# EAGLE design Analog_Greippi (EAGLE 7.4.0)
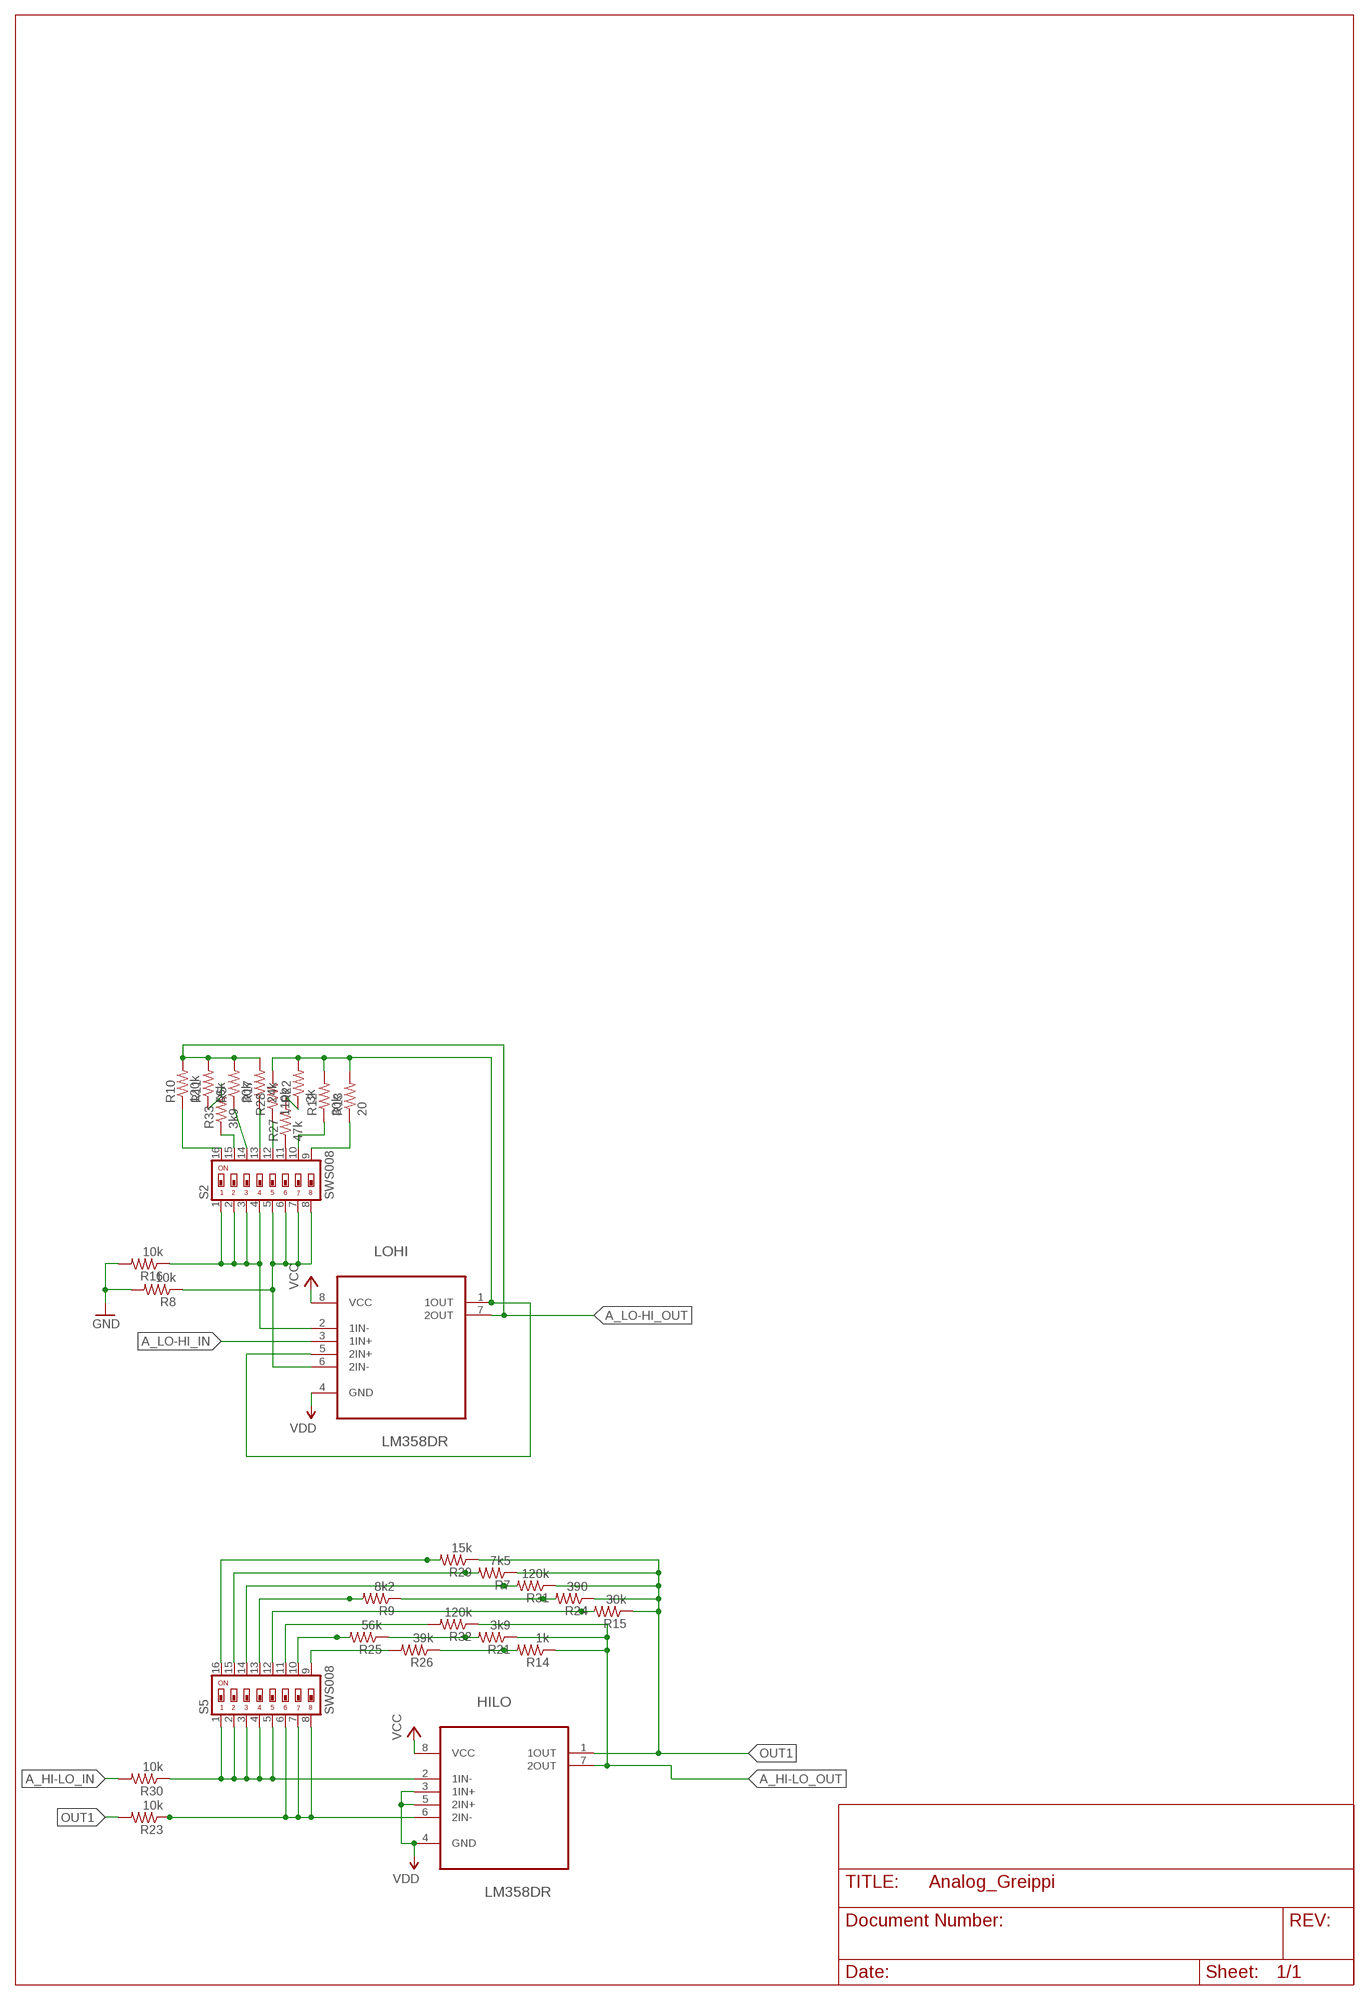
[diagram p0: schematic, sheet 1]

## Parts
HILO  LM358DR  [SOIC127P600X175-8N]
LOHI  LM358DR  [SOIC127P600X175-8N]
R5  30k  R-US_R0805  [R0805]
R7  7k5  R-US_R0805  [R0805]
R8  10k  R-US_R0805  [R0805]
R9  8k2  R-US_R0805  [R0805]
R10  120k  R-US_R0805  [R0805]
R11  56k  R-US_R0805  [R0805]
R12  30k  R-US_R0805  [R0805]
R13  20  R-US_R0805  [R0805]
R14  1k  R-US_R0805  [R0805]
R15  30k  R-US_R0805  [R0805]
R16  10k  R-US_R0805  [R0805]
R17  24k  R-US_R0805  [R0805]
R21  3k9  R-US_R0805  [R0805]
R22  3k  R-US_R0805  [R0805]
R23  10k  R-US_R0805  [R0805]
R24  390  R-US_R0805  [R0805]
R25  56k  R-US_R0805  [R0805]
R26  39k  R-US_R0805  [R0805]
R27  47k  R-US_R0805  [R0805]
R28  110k  R-US_R0805  [R0805]
R29  15k  R-US_R0805  [R0805]
R30  10k  R-US_R0805  [R0805]
R31  120k  R-US_R0805  [R0805]
R32  120k  R-US_R0805  [R0805]
R33  3k9  R-US_R0805  [R0805]
S2  SWS008  [SMS-008]
S5  SWS008  [SMS-008]

## Nets
A_HI-LO_IN: R30.2
A_HI-LO_OUT: HILO.7(2OUT) R14.1 R21.1 R32.1
A_LO-HI_IN: LOHI.3(1IN+)
A_LO-HI_OUT: LOHI.7(2OUT) R5.2 R10.2 R11.2 R17.2
GND: R8.2 R16.2
N$10: HILO.2(1IN-) R30.1 S5.1 S5.2 S5.3 S5.4 S5.5
N$13: R10.1 S2.16
N$14: R33.1 S2.15
N$16: R5.1 S2.14
N$17: R17.1 S2.13
N$18: R28.1 S2.12
N$19: R27.1 S2.11
N$20: R12.1 S2.10
N$21: R13.1 S2.9
N$22: R29.2 S5.16
N$23: LOHI.1(1OUT) LOHI.5(2IN+) R12.2 R13.2 R22.2 R28.2
N$24: R7.2 S5.15
N$26: R31.2 S5.14
N$27: R9.2 S5.13
N$28: R15.2 S5.12
N$29: R32.2 S5.11
N$30: HILO.6(2IN-) R23.1 S5.6 S5.7 S5.8
N$31: R25.2 S5.10
N$32: R26.2 S5.9
N$34: R14.2 R26.1
N$36: R21.2 R25.1
N$37: R9.1 R24.2
N$38: R22.1 R27.2
N$41: R11.1 R33.2
N$46: LOHI.2(1IN-) R16.1 S2.1 S2.2 S2.3 S2.4
N$50: LOHI.6(2IN-) R8.1 S2.5 S2.6 S2.7 S2.8
OUT1: HILO.1(1OUT) R7.1 R15.1 R23.2 R24.1 R29.1 R31.1
VCC: HILO.8(VCC) LOHI.8(VCC)
VDD: HILO.3(1IN+) HILO.4(GND) HILO.5(2IN+) LOHI.4(GND)

## Library data of the parts
HILO LOHI = Texas Instruments_By_element14_Batch_1:LM358DR: OPERATIONAL AMPLIFIERS; MPN: LM358DR; OC_FARNELL: 1831865; OC_NEWARK: 34K7599; PACKAGE: SOIC-8; SUPPLIER: Texas Instruments
R5 R7-R17 R21-R33 = rcl:R-US_: RESISTOR, American symbol
S2 S5 = smd-special:SWS008: SMD Dip Switch 8 pol.

## Board
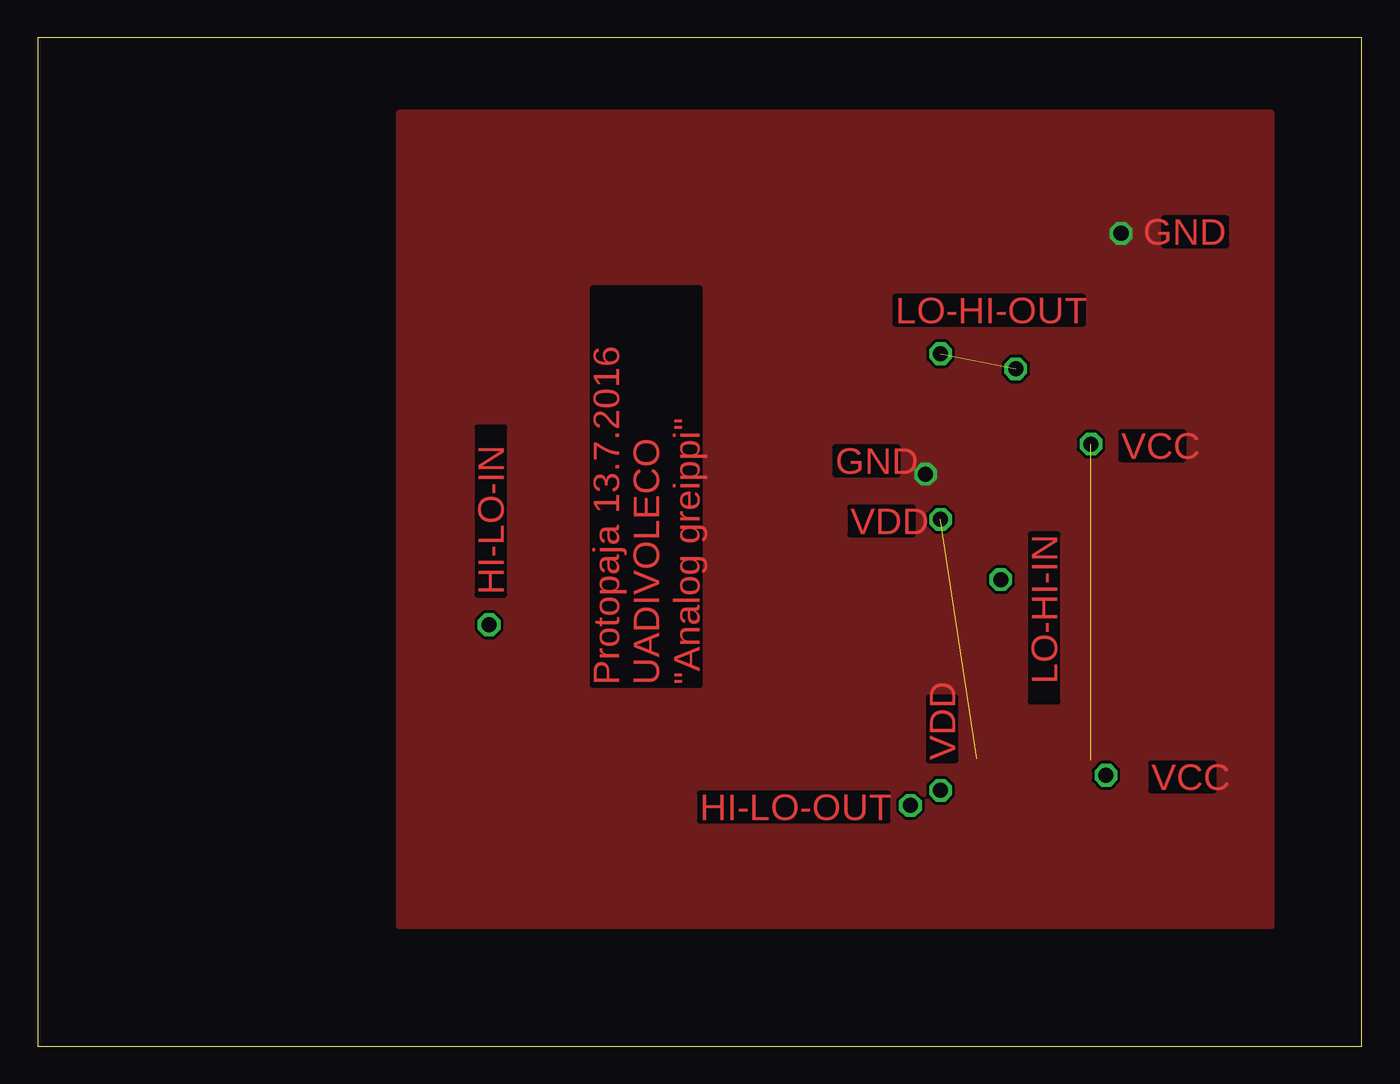
[diagram p1: board, top side]
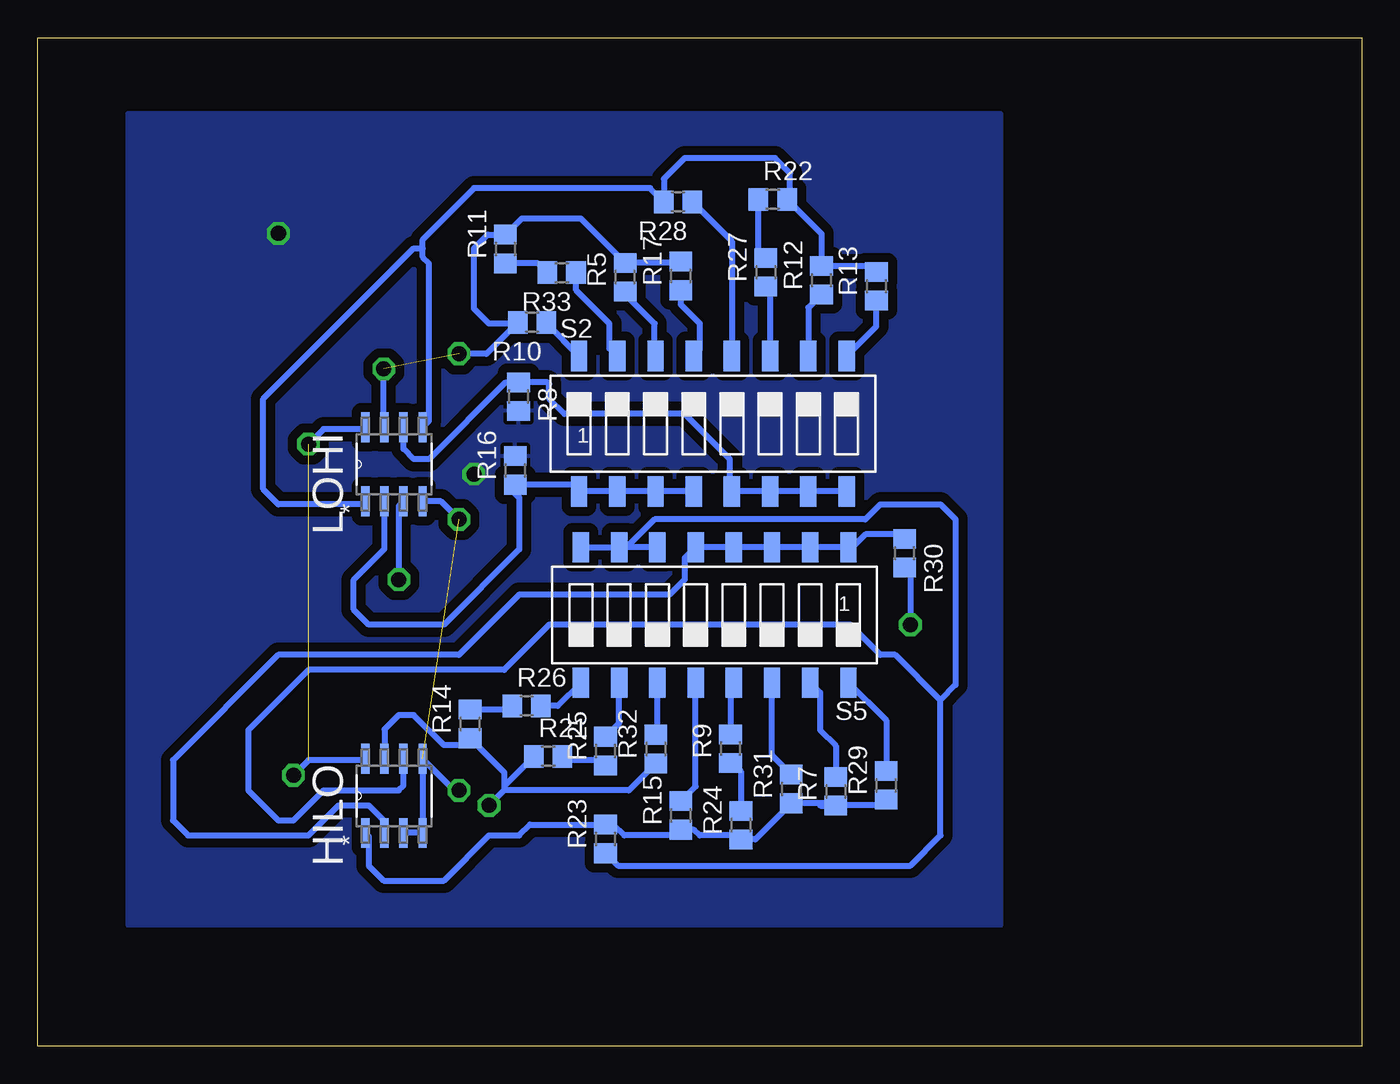
[diagram p2: board, bottom side, seen from below]

Size 88 x 67 mm. Coordinates in mm from the lower left corner, seen from the top.
Outline: 0,0 88,0 88,67 0,67 0,0
Copper layers (1*16): Top 0.035mm / dielectric 1.5mm / Bottom 0.035mm
Design rules "default": minimum track width 10mil, minimum drill 24mil, track to track 8mil, track to pad 8mil, pad to pad 8mil, via to via 8mil, smd to smd 8mil, copper to edge 40mil, drill to drill 8mil, minimum pad ring 10mil, minimum via ring 8mil, stop-mask expansion 4mil, vias tented up to drill 0mil, thermal gap 10mil

### Footprints (pad centres in the part's own frame; a part is rotated, then mirrored left to right if it is on the bottom)
SOIC127P600X175-8N = smd 1.981 x 0.559: 1 -2.464,1.905; 2 -2.464,0.635; 3 -2.464,-0.635; 4 -2.464,-1.905; 5 2.464,-1.905; 6 2.464,-0.635; 7 2.464,0.635; 8 2.464,1.905
R0805 = smd 1.3 x 1.5: 1 -0.95,0; 2 0.95,0
SMS-008 = smd 1.092 x 2.007: 1 -8.89,-4.496; 2 -6.35,-4.496; 3 -3.81,-4.496; 4 -1.27,-4.496; 5 1.27,-4.496; 6 3.81,-4.496; 7 6.35,-4.496; 8 8.89,-4.496; 9 8.89,4.496; 10 6.35,4.496; 11 3.81,4.496; 12 1.27,4.496; 13 -1.27,4.496; 14 -3.81,4.496; 15 -6.35,4.496; 16 -8.89,4.496

### Placement (x,y rotation side)
HILO  64.32,16.63 90 bottom
LOHI  64.32,38.66 90 bottom
R5  48.96,51.09 90 bottom
R7  34.96,16.93 90 bottom
R8  56.04,43.15 270 bottom
R9  41.96,19.77 90 bottom
R10  55.14,48.09 180 bottom
R11  56.91,52.96 90 bottom
R12  35.91,50.88 90 bottom
R13  32.26,50.49 90 bottom
R14  59.26,21.41 90 bottom
R15  45.26,15.33 90 bottom
R16  56.26,38.25 90 bottom
R17  45.26,51.17 90 bottom
R21  54.07,19.26 0 bottom
R22  39.15,56.26 0 bottom
R23  50.26,13.77 90 bottom
R24  41.26,14.69 90 bottom
R25  50.26,19.61 90 bottom
R26  55.51,22.61 0 bottom
R27  39.61,51.41 90 bottom
R28  45.44,56.09 180 bottom
R29  31.61,17.33 90 bottom
R30  30.39,32.75 270 bottom
R31  37.91,17.09 90 bottom
R32  46.91,19.74 90 bottom
R33  53.17,51.39 180 bottom
S2  43.13,41.35 0 bottom
S5  43.01,28.65 180 bottom

### Tracks (layer width: path | path; a pad name or v marks a point on that pad's centre or on a via)
A_HI-LO_IN  (via drill 1 pad 1.42)
  Bottom 0.406: R30.2 30,31.41 v30,28
A_HI-LO_OUT  (via drill 1 pad 1.42)
  Bottom 0.406: R32.1 48.7,17 57,17 | 57,17 v58,16 | R21.1 57,17.28 | 57,17.28 57,17 | 57,17.28 57,18.2 R14.1 59.72,20 61,20 63,22 64,22 64.95,21.05 HILO.7
A_LO-HI_IN  (via drill 1 pad 1.42)
  Bottom 0.406: LOHI.3 64,35.88 v64,31
A_LO-HI_OUT  (via drill 1 pad 1.42)  (1 unrouted)
  Bottom 0.406: R17.2 45.34,52.04 R5.2 51.92,55 55.82,55 R11.2 58.09,53.91 59,53 59,49 58,48 56.18,48 R10.2 58.18,46 v60,46 | LOHI.7 65,41.17 v65,45
GND  (via drill 1 pad 1.42)
  other vias: 59,38 72,54
  pour Bottom (isolate 0.61): 24,62 24,8 82,8 82,62
  pour Top: 24,62 24,8 82,8 82,62
N$10
  Bottom 0.406: R30.1 30.69,34 33,34 33.85,33.15 S5.1 S5.2 S5.3 S5.4 S5.5 45,32.43 45,31 46,30 56,30 60,26 72,26 79,19 79,15 78,14 70,14 68,16 66,16 64.95,14.96 HILO.2
N$13
  Bottom 0.406: S2.16 54.19,48.02 R10.1
N$14
  Bottom 0.406: S2.15 50,46.37 50,48 52.22,50.22 R33.1
N$16
  Bottom 0.406: S2.14 47,45.91 47,48 48.96,49.96 R5.1
N$17
  Bottom 0.406: S2.13 44,46.25 44,48 45.26,49.26 R17.1
N$18
  Bottom 0.406: R28.1 41.86,53.46 S2.12
N$19
  Bottom 0.406: R27.1 39.32,50.17 S2.11
N$20
  Bottom 0.406: R12.1 36.78,49.06 S2.10
N$21
  Bottom 0.406: S2.9 32.26,47.83 R13.1
N$22
  Bottom 0.406: S5.16 31.61,21.64 R29.2
N$23
  Bottom 0.406: R13.2 32.65,51.83 R12.2 35.91,53.97 R22.2 38,56.46 38,58 39,59 45,59 46.39,57.61 R28.2 47.3,57 59,57 62.41,53.59 62.41,53 | LOHI.5 62,41.54 62,52 62.41,52.41 62.41,53 | LOHI.1 66.42,36 72,36 73,37 73,43 63,53 62.41,53
N$24
  Bottom 0.406: S5.15 36,23.49 36,21 34.96,19.96 R7.2
N$26
  Bottom 0.406: R31.2 39.2,19.33 S5.14
N$27
  Bottom 0.406: S5.13 41.96,23.93 R9.2
N$28
  Bottom 0.406: R15.2 44.28,17.26 S5.12
N$29
  Bottom 0.406: R32.2 46.82,20.78 S5.11
N$30
  Bottom 0.406: S5.7 48.85,33.15 47,35 33,35 32,36 28,36 27,35 27,24 28,23 | S5.6 S5.7 | S5.8 S5.7 | R23.1 49.44,12 30,12 28,14 28,23 | 28,23 31,26 32,26 34,28 54,28 57,25 70,25 74,21 74,17 72,15 71,15 69,17 64,17 63.69,17.31 HILO.6
N$31
  Bottom 0.406: R25.2 49.36,21.46 S5.10
N$32
  Bottom 0.406: S5.9 53.44,22.61 R26.2
N$34
  Bottom 0.406: R26.1 56.71,22.36 R14.2
N$36
  Bottom 0.406: R25.1 50.6,19 53,19 53.12,19.12 R21.2
N$37
  Bottom 0.406: R9.1 42,18.86 42,19 41.26,18.26 R24.2
N$38
  Bottom 0.406: R27.2 40.1,52.85 R22.1
N$41
  Bottom 0.406: R33.2 54.74,52.01 R11.1
N$46
  Bottom 0.406: S2.4 S2.3 S2.2 S2.1 52.47,37.3 R16.1 56.56,37 56,36.44 56,33 61,28 66,28 67,29 67,31 64.95,33.05 LOHI.2
N$50
  Bottom 0.406: S2.8 S2.7 S2.6 S2.5 42,36.99 42,39 45,42 53,42 54,43 54,44 54.1,44.1 R8.1 56.9,44.1 62,39 63,39 63.69,39.69 LOHI.6
OUT1
  Bottom 0.406: R29.1 31.99,16 36,16 35.98,15.98 R7.1 35.12,16.14 R31.1 40.31,13.74 R24.1 41.52,14 44,14 44.38,14.38 R15.1 45.64,14 49,14 49.72,14.72 R23.2 55.28,14.72 56,14 58,14 61,11 65,11 66,12 66,13.94 HILO.1
VCC  (via drill 1 pad 1.42)  (1 unrouted)
  Bottom 0.406: HILO.8 66.32,19 70,19 v71,18 | LOHI.8 66.35,41 69,41 v70,40
VDD  (via drill 1 pad 1.42)  (1 unrouted)
  Bottom 0.406: HILO.3 HILO.4 HILO.5 60.32,17 v60,17 | v60,35 61.2,36.2 LOHI.4

### Text on the board
Top: GND | LO-HI-OUT | VCC | GND | VDD | LO-HI-IN | HI-LO-IN | Protopaja 13.7.2016 / UADIVOLECO / "Analog greippi" | VDD | VCC | HI-LO-OUT